# Altium schematic sheet DCSupplyHub.SchDoc
size A2; SheetNumber: 1; SheetTotal: 1
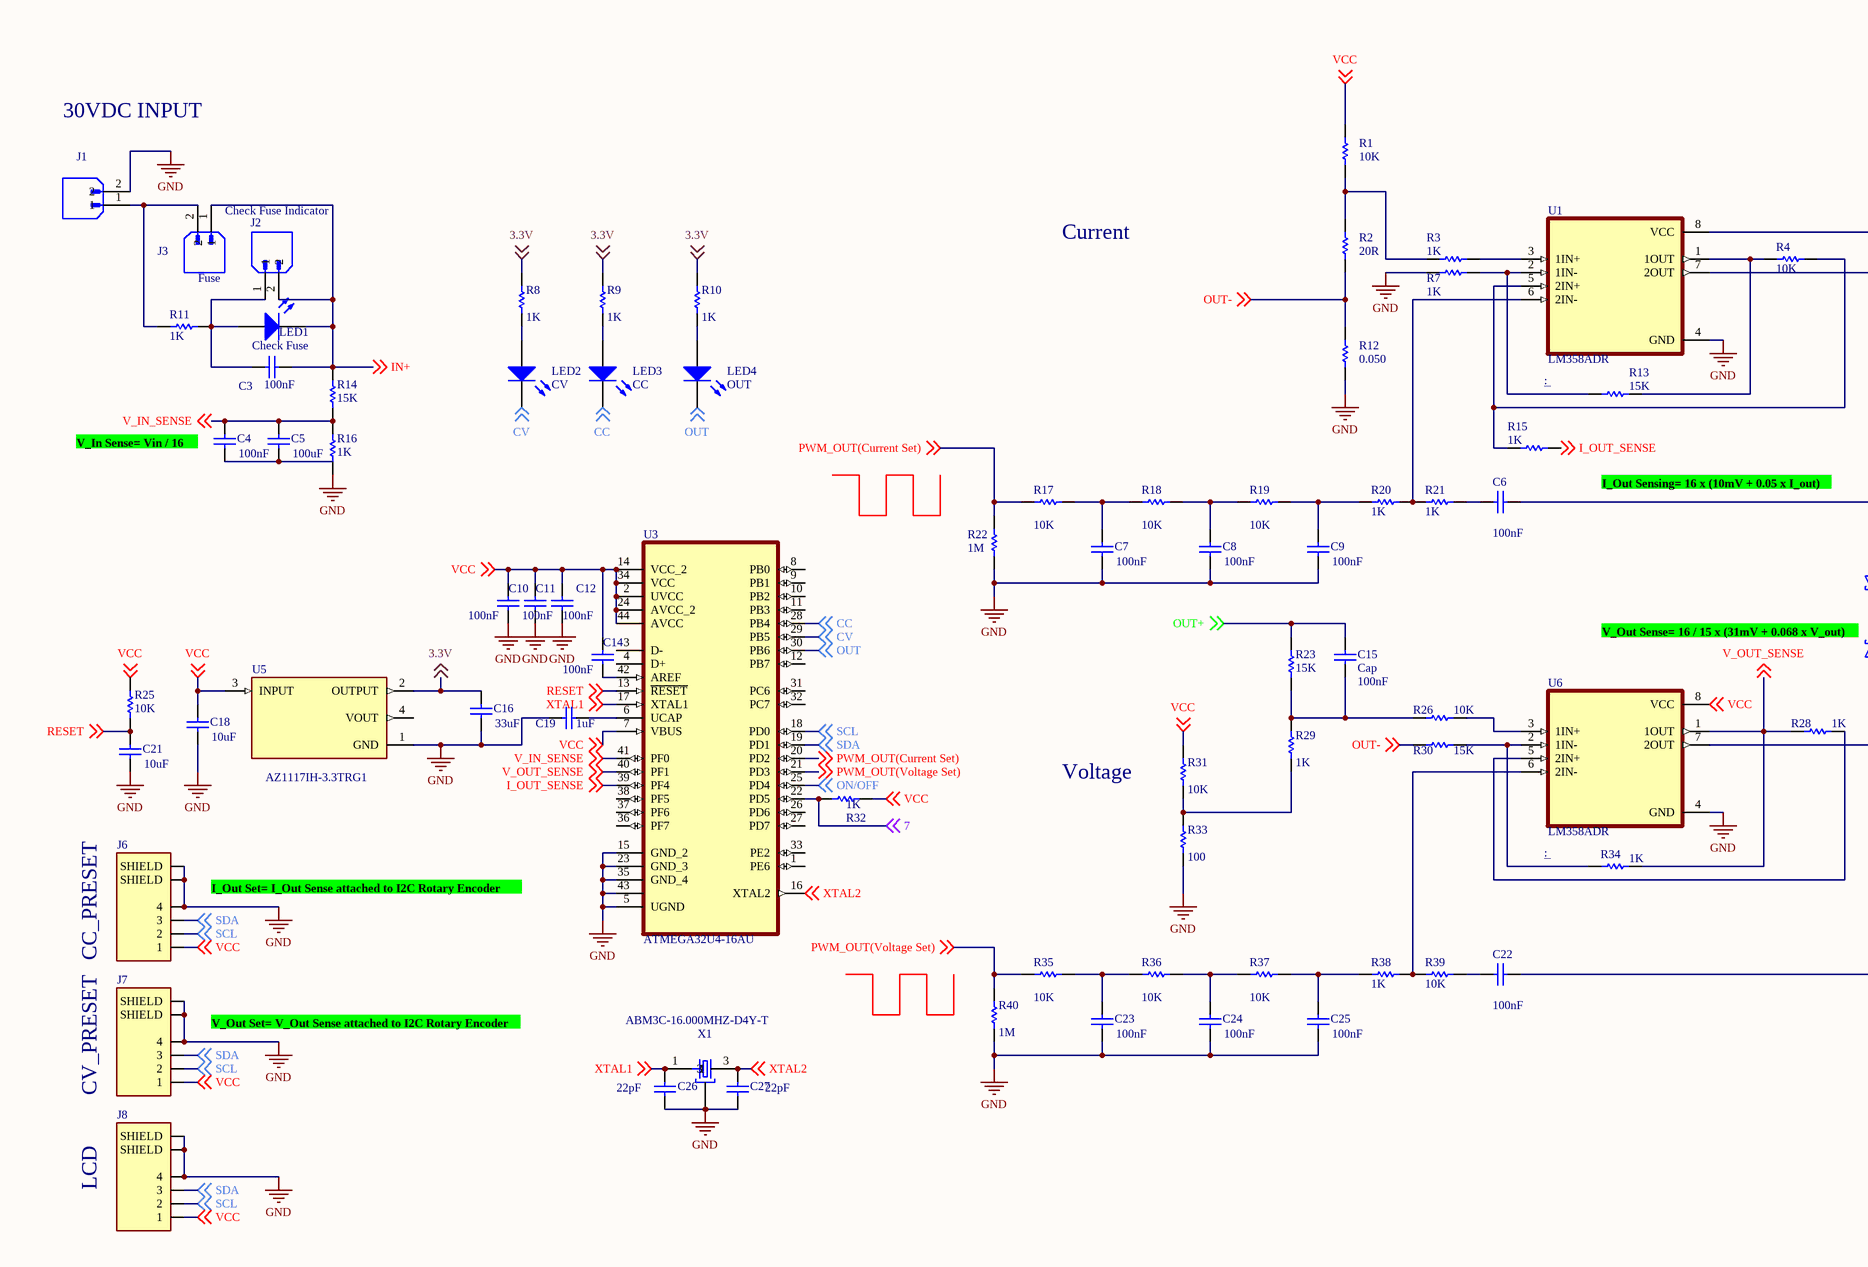
[diagram p0: DCSupplyHub.SchDoc, left]
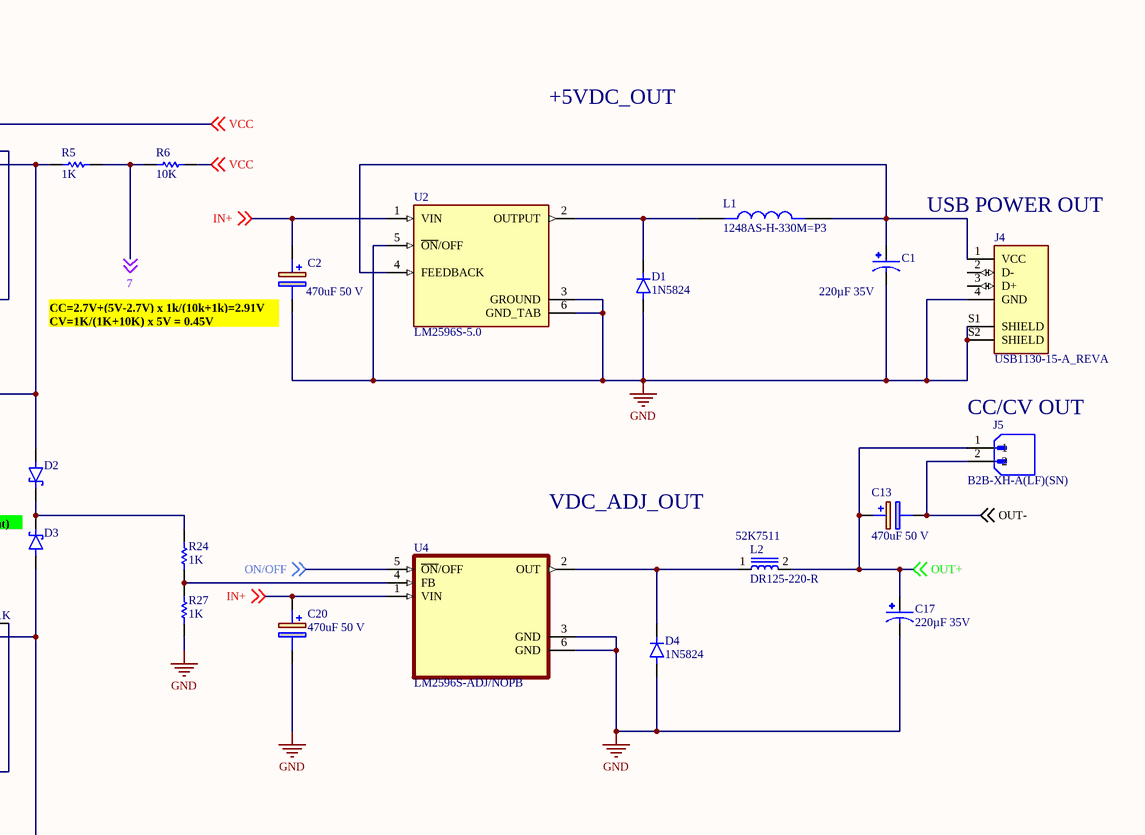
[diagram p1: DCSupplyHub.SchDoc, right]

## Parts
C1  Parameter 1: 220µF 35V  [CAP_EEEFP1V221AP]  (hidden comment: EEEFP1V221AP)
C2  value 470uF 50 V  [CAPAE1710X1700N]  (hidden comment: 865060663013)
C3  value 100nF  [CAPC3216X110N]  (hidden comment: Cap)
C4  value 100nF  [CAPC3216X110N]  (hidden comment: Cap)
C5  value 100uF  [CAPC3216X110N]  (hidden comment: Cap)
C6  value 100nF  [CAPC3216X110N]  (hidden comment: Cap)
C7  value 100nF  [CAPC3216X110N]  (hidden comment: Cap)
C8  value 100nF  [CAPC3216X110N]  (hidden comment: Cap)
C9  value 100nF  [CAPC3216X110N]  (hidden comment: Cap)
C10  value 100nF  [CAPC3216X110N]  (hidden comment: Cap)
C11  value 100nF  [CAPC3216X110N]  (hidden comment: Cap)
C12  value 100nF  [CAPC3216X110N]  (hidden comment: Cap)
C13  value 470uF 50 V  [CAPAE1710X1700N]  (hidden comment: 865060663013)
C14  value 100nF  [CAPC3216X110N]  (hidden comment: Cap)
C15  Cap  value 100nF  [CAPC3216X110N]
C16  value 33uF  [CAPC3216X110N]  (hidden comment: Cap)
C17  Parameter 1: 220µF 35V  [CAP_EEEFP1V221AP]  (hidden comment: EEEFP1V221AP)
C18  value 10uF  [CAPC3216X110N]  (hidden comment: Cap)
C19  value 1uF  [CAPC3216X110N]  (hidden comment: Cap)
C20  value 470uF 50 V  [CAPAE1710X1700N]  (hidden comment: 865060663013)
C21  value 10uF  [CAPC3216X110N]  (hidden comment: Cap)
C22  value 100nF  [CAPC3216X110N]  (hidden comment: Cap)
C23  value 100nF  [CAPC3216X110N]  (hidden comment: Cap)
C24  value 100nF  [CAPC3216X110N]  (hidden comment: Cap)
C25  value 100nF  [CAPC3216X110N]  (hidden comment: Cap)
C26  value 22pF  [CAPC3216X110N]  (hidden comment: Cap)
C27  value 22pF  [CAPC3216X110N]  (hidden comment: Cap)
D1  1N5824  [DIOAD1898W129L762D1143]
D2  SD1206S020S1R0  [DIOSC190X340X116-2N]  (value not drawn)
D3  SD1206S020S1R0  [DIOSC190X340X116-2N]  (value not drawn)
D4  1N5824  [DIOAD1898W129L762D1143]
J1  B2B-XH-A(LF)(SN)  [JST_B2B-XH-A(LF)(SN)]  (value not drawn)
J2  Check Fuse Indicator  [JST_B2B-XH-A(LF)(SN)]
J3  Fuse  [JST_B2B-XH-A(LF)(SN)]
J4  USB1130-15-A_REVA  [GCT_USB1130-15-A_REVA]
J5  B2B-XH-A(LF)(SN)  [JST_B2B-XH-A(LF)(SN)]
J6  CC_PRESET  [JST_SM04B-SRSS-TB(LF)(SN)]
J7  CV_PRESET  [JST_SM04B-SRSS-TB(LF)(SN)]
J8  LCD  [JST_SM04B-SRSS-TB(LF)(SN)]
L1  1248AS-H-330M=P3  [IND_1248AS-H-330M=P3]
L2  DR125-220-R  Supplier Part Number 1: 52K7511  [INDM1250X1250X600]
LED1  Check Fuse  [3.2X1.6X1.1]
LED2  CV  [3.2X1.6X1.1]
LED3  CC  [3.2X1.6X1.1]
LED4  OUT  [3.2X1.6X1.1]
R1  value 10K  [RESC3116X60N]  (hidden comment: Res1)
R2  value 20R  [RESC3116X60N]  (hidden comment: Res1)
R3  value 1K  [RESC3116X60N]  (hidden comment: Res1)
R4  value 10K  [RESC3116X60N]  (hidden comment: Res1)
R5  value 1K  [RESC3116X60N]  (hidden comment: Res1)
R6  value 10K  [RESC3116X60N]  (hidden comment: Res1)
R7  value 1K  [RESC3116X60N]  (hidden comment: Res1)
R8  value 1K  [RESC3116X60N]  (hidden comment: Res1)
R9  value 1K  [RESC3116X60N]  (hidden comment: Res1)
R10  value 1K  [RESC3116X60N]  (hidden comment: Res1)
R11  value 1K  [RESC3116X60N]  (hidden comment: Res1)
R12  value 0.050  [RESC3116X60N]  (hidden comment: Res1)
R13  value 15K  [RESC3116X60N]  (hidden comment: Res1)
R14  value 15K  [RESC3116X60N]  (hidden comment: Res1)
R15  value 1K  [RESC3116X60N]  (hidden comment: Res1)
R16  value 1K  [RESC3116X60N]  (hidden comment: Res1)
R17  value 10K  [RESC3116X60N]  (hidden comment: Res1)
R18  value 10K  [RESC3116X60N]  (hidden comment: Res1)
R19  value 10K  [RESC3116X60N]  (hidden comment: Res1)
R20  value 1K  [RESC3116X60N]  (hidden comment: Res1)
R21  value 1K  [RESC3116X60N]  (hidden comment: Res1)
R22  value 1M  [RESC3116X60N]  (hidden comment: Res1)
R23  value 15K  [RESC3116X60N]  (hidden comment: Res1)
R24  value 1K  [RESC3116X60N]  (hidden comment: Res1)
R25  value 10K  [RESC3116X60N]  (hidden comment: Res1)
R26  value 10K  [RESC3116X60N]  (hidden comment: Res1)
R27  value 1K  [RESC3116X60N]  (hidden comment: Res1)
R28  value 1K  [RESC3116X60N]  (hidden comment: Res1)
R29  value 1K  [RESC3116X60N]  (hidden comment: Res1)
R30  value 15K  [RESC3116X60N]  (hidden comment: Res1)
R31  value 10K  [RESC3116X60N]  (hidden comment: Res1)
R32  value 1K  [RESC3116X60N]  (hidden comment: Res1)
R33  value 100  [RESC3116X60N]  (hidden comment: Res1)
R34  value 1K  [RESC3116X60N]  (hidden comment: Res1)
R35  value 10K  [RESC3116X60N]  (hidden comment: Res1)
R36  value 10K  [RESC3116X60N]  (hidden comment: Res1)
R37  value 10K  [RESC3116X60N]  (hidden comment: Res1)
R38  value 1K  [RESC3116X60N]  (hidden comment: Res1)
R39  value 10K  [RESC3116X60N]  (hidden comment: Res1)
R40  value 1M  [RESC3116X60N]  (hidden comment: Res1)
U1  LM358ADR  [SOIC127P599X175-8N]
U2  LM2596S-5.0  [TO170P1524X483-6N]
U3  ATMEGA32U4-16AU  [QFP80P1200X1200X120-44N]
U4  LM2596S-ADJ/NOPB  [VREG_LM2596S-ADJ/NOPB]
U5  AZ1117IH-3.3TRG1  [SOT230P700X185-4N]
U6  LM358ADR  [SOIC127P599X175-8N]
X1  ABM3C-16.000MHZ-D4Y-T  [OSCCC500X320X110-4N]

## Nets
GND: C1.2 C2.2(-) C7.1 C8.1 C9.1 C10.1 C11.1 C12.1 C16.1 C17.2 C18.1 C19.2 C20.2(-) C21.1 C23.1 C24.1 C25.1 C26.1 C27.1 D1.A D4.A J1.2 J4.4(GND) J4.S1(SHIELD) J4.S2(SHIELD) J6.4 J6.S1(SHIELD) J6.S2(SHIELD) J7.4 J7.S1(SHIELD) J7.S2(SHIELD) J8.4 J8.S1(SHIELD) J8.S2(SHIELD) R7.1 R12.1 R16.2 R22.1 R27.2 R33.1 R40.1 U1.4(GND) U2.3(GROUND) U2.5(~{ON}/OFF) U2.6(GND_TAB) U3.5(UGND) U3.15(GND_2) U3.23(GND_3) U3.35(GND_4) U3.43(GND) U4.3(GND) U4.6(GND) U5.1(GND) U6.4(GND) X1.2(GND) X1.4(GND)
3.3V: C16.2 R8.1 R9.1 R10.1 U5.2(OUTPUT) ; off-sheet 3.3V
7: R5.2 R6.1 R32.2 U3.22(PD5) ; off-sheet 7
CC: LED3.2(K) U3.28(PB4) ; off-sheet CC
CV: LED2.2(K) U3.29(PB5) ; off-sheet CV
I_OUT_SENSE: R15.1 U3.39(PF4) ; off-sheet I_OUT_SENSE
IN+: C2.1(+) C3.1 C20.1(+) J2.2 J3.1 LED1.2(K) R14.1 U2.1(VIN) U4.1(VIN) ; off-sheet IN+
ON/OFF: U3.25(PD4) U4.5(~{ON}/OFF) ; off-sheet ON/OFF
OUT: LED4.2(K) U3.30(PB6) ; off-sheet OUT
OUT+: C13.1(+) C15.1 C17.1 J5.1 L2.2 R23.2 ; off-sheet OUT+
OUT-: C13.2(-) J5.2 R2.2 R12.2 R30.1 ; off-sheet OUT-
PWM_OUT(Current Set): R17.2 R22.2 U3.20(PD2) ; off-sheet PWM_OUT(Current Set)
PWM_OUT(Voltage Set): R35.2 R40.2 U3.21(PD3) ; off-sheet PWM_OUT(Voltage Set)
RESET: C21.2 R25.2 U3.13(~{RESET}) ; off-sheet RESET
SCL: J6.2 J7.2 J8.2 U3.18(PD0) ; off-sheet SCL
SDA: J6.3 J7.3 J8.3 U3.19(PD1) ; off-sheet SDA
V_IN_SENSE: C4.2 C5.2 R14.2 R16.1 U3.41(PF0) ; off-sheet V_IN_SENSE
V_OUT_SENSE: R28.1 R34.2 U3.40(PF1) U6.1(1OUT) ; off-sheet V_OUT_SENSE
VCC: C10.2 C11.2 C12.2 C14.2 C18.2 J6.1 J7.1 J8.1 R1.2 R6.2 R25.1 R31.1 R32.1 U1.8(VCC) U3.2(UVCC) U3.7(VBUS) U3.14(VCC_2) U3.24(AVCC_2) U3.34(VCC) U3.44(AVCC) U5.3(INPUT) U6.8(VCC) ; off-sheet VCC
XTAL1: C26.2 U3.17(XTAL1) X1.1 ; off-sheet XTAL1
XTAL2: C27.2 U3.16(XTAL2) X1.3 ; off-sheet XTAL2
NetC1_1: C1.1 J4.1(VCC) L1.2 U2.4(FEEDBACK)
NetC3_2: C3.2 J2.1 LED1.1(A) R11.2
NetC4_1: C4.1 C5.1
NetC6_1: C6.1 R21.2
NetC6_2: C6.2 D2.A R5.1 U1.7(2OUT)
NetC7_2: C7.2 R17.1 R18.2
NetC8_2: C8.2 R18.1 R19.2
NetC9_2: C9.2 R19.1 R20.1
NetC14_1: C14.1 U3.42(AREF)
NetC15_2: C15.2 R23.1 R26.1 R29.1
NetC19_1: C19.1 U3.6(UCAP)
NetC22_1: C22.1 R39.2
NetC22_2: C22.2 D3.A U6.7(2OUT)
NetC23_2: C23.2 R35.1 R36.2
NetC24_2: C24.2 R36.1 R37.2
NetC25_2: C25.2 R37.1 R38.1
NetD1_C: D1.C(K) L1.1 U2.2(OUTPUT)
NetD2_C: D2.C(K) D3.C(K) R24.1
NetD4_C: D4.C(K) L2.1 U4.2(OUT)
NetJ1_1: J1.1 J3.2 R11.1
NetLED2_1: LED2.1(A) R8.2
NetLED3_1: LED3.1(A) R9.2
NetLED4_1: LED4.1(A) R10.2
NetR1_1: R1.1 R2.1 R3.1
NetR3_2: R3.2 U1.3(1IN+)
NetR4_1: R4.1 R13.2 U1.1(1OUT)
NetR4_2: R4.2 R15.2 U1.5(2IN+)
NetR7_2: R7.2 R13.1 U1.2(1IN-)
NetR20_2: R20.2 R21.1 U1.6(2IN-)
NetR24_2: R24.2 R27.1 U4.4(FB)
NetR26_2: R26.2 U6.3(1IN+)
NetR28_2: R28.2 U6.5(2IN+)
NetR29_2: R29.2 R31.2 R33.2
NetR30_2: R30.2 R34.1 U6.2(1IN-)
NetR38_2: R38.2 R39.1 U6.6(2IN-)

Not connected (* = marked no-connect by the designer): J4 2(D-) 3(D+); U3 1(PE6) 3(D-) 4(D+) 8(PB0) 9(PB1) 10(PB2) 11(PB3) 12(PB7) 26(PD6) 27(PD7) 31(PC6) 32(PC7) 33(PE2) 36(PF7) 37(PF6) 38(PF5); U5 4(VOUT)

## Notes on the sheet
- 30VDC INPUT
- Current
- +5VDC_OUT
- USB POWER OUT
- (near C4) V_In Sense= Vin / 16
- (near C2) CC=2.7V+(5V-2.7V) x 1k/(10k+1k)=2.91V
- (near C2) CV=1K/(1K+10K) x 5V = 0.45V
- I_Out Sensing= 16 x (10mV + 0.05 x I_out)
- (near J5) CC/CV OUT
- (near D3) V_Out Sense= 16 / 15 x (31mV + 0.068 x V_out)
- VDC_ADJ_OUT
- Voltage
- (near J6) I_Out Set= I_Out Sense attached to I2C Rotary Encoder
- (near J7) V_Out Set= V_Out Sense attached to I2C Rotary Encoder

## Library data of the parts
C1 C17 = EEEFP1V221AP: 220ÂµF 35V Aluminum Electrolytic Capacitors Radial, Can - SMD 80mOhm @ 100kHz 2000 Hrs @ 105Â°C; MP: EEE-FP1V221AP; MF: Panasonic Electronic; Availability: In Stock; SnapEDA_Link: https://www.snapeda.com/parts/EEE-FP1V221AP/Panasonic%20Electronic%20Components/view-part/2297683/?ref=snap; Value: *; Price: None; Package: RADIAL-2 Panasonic; Check_prices: https://www.snapeda.com/parts/EEE-FP1V221AP/Panasonic%20Electronic%20Components/view-part/2297683/?ref=eda; Purchase-URL: https://pricing.snapeda.com/search/part/EEE-FP1V221AP/?ref=eda
C2 C13 C20 = 865060663013: Wurth Elektronik 470uF 50 V dc Aluminium Electrolytic Capacitor, WCAP-ASLL Series 5000h 17 (Dia.) x 15.85mm; Geometry.Height: 17mm; Manufacturer_Name: Wurth Elektronik; Manufacturer_Part_Number: 865060663013; Mouser Part Number: 710-865060663013; Mouser Price/Stock: https://www.mouser.co.uk/ProductDetail/Wurth-Elektronik/865060663013?qs=0KOYDY2FL2%2FaLIoB1obSkw%3D%3D; Arrow Part Number: *; Arrow Price/Stock: *; Datasheet Link: https://componentsearchengine.com/Datasheets/2/865060663013.pdf
  C20: Parameter 2: *; Parameter 3: *
C3-C12 C14-C16 C18 C19 C21-C27 = Cap: Capacitor; Published: 8-Jun-2000; LatestRevisionDate: 17-Jul-2002; LatestRevisionNote: Re-released for DXP Platform.; PackageReference: RAD-0.3; Publisher: Altium Limited; PackageDescription: Radial Cap, Thru-Hole; 2 Leads; 0.3 in Pin Spacing
D1 D4 = 1N5824: Diode Schottky 30V 5A Through Hole Axial; MF: Microsemi Corporation; Value: *; SnapEDA_Link: https://www.snapeda.com/parts/1N5824/Microsemi%20Corporation/view-part/49055/?ref=snap; MP: 1N5824; Availability: Unavailable; Price: None; Package: Axial Microsemi
D2 D3 = SD1206S020S1R0: Diode Schottky 20 V 1A (DC) Surface Mount 1206 (3216 Metric); MF: AVX; MP: SD1206S020S1R0; Price: None; Purchase-URL: https://pricing.snapeda.com/search/part/SD1206S020S1R0/?ref=eda; Package: None; Check_prices: https://www.snapeda.com/parts/SD1206S020S1R0/AVX/view-part/?ref=eda; Value: *; Availability: In Stock; SnapEDA_Link: https://www.snapeda.com/parts/SD1206S020S1R0/AVX/view-part/?ref=snap
J1-J3 J5 = B2B-XH-A(LF)(SN): Connector Header Through Hole 2 position 0.098 (2.50mm); MF: JST Sales; SnapEDA_Link: https://www.snapeda.com/parts/B2B-XH-A(LF)(SN)/JST+Sales+America+Inc./view-part/?ref=snap; Package: None; Value: *; MP: B2B-XH-A(LF)(SN); Check_prices: https://www.snapeda.com/parts/B2B-XH-A(LF)(SN)/JST+Sales+America+Inc./view-part/?ref=eda
J4 = USB1130-15-A_REVA: USB 2.0 Connector Full size Horizontal Plug, type A, 4 Pins, Through hole, Top mount, 6.99mm profile, High mating cycle, charging receptacle; MF: Global Connector Technology; Price: None; Availability: In Stock; Package: None; MP: USB1130-15-A; Value: *; SnapEDA_Link: https://www.snapeda.com/parts/USB1130-15-A/Global+Connector+Technology/view-part/?ref=snap; Purchase-URL: https://pricing.snapeda.com/search/part/USB1130-15-A/?ref=eda; Check_prices: https://www.snapeda.com/parts/USB1130-15-A/Global+Connector+Technology/view-part/?ref=eda
J6-J8 = SM04B-SRSS-TB(LF)(SN): SH Series 1.0 mm Pitch 2 Position Single Row Side Entry Shrouded Header; Price: None; Value: *; MP: SM04B-SRSS-TB(LF)(SN); Package: None; Availability: Unavailable
L1 = 1248AS-H-330M=P3: Inductor with Inductance: 33uH Tol. +/-20%, Package: 3131 _8080_; MF: Murata; Digi-Key_Purchase_URL: https://www.digikey.com/product-detail/en/murata-electronics/1248AS-H-330M=P3/490-10797-1-ND/5271539?utm_source=snapeda&utm_medium=aggregator&utm_campaign=symbol; Digi-Key_Part_Number: 490-10797-1-ND; MP: 1248AS-H-330M=P3; Value: *; SnapEDA_Link: https://www.snapeda.com/parts/1248AS-H-330M%3DP3/Murata/view-part/4548511/?ref=snap; Package: - Murata
L2 = DR125-220-R: Inductor Power Shielded Drum Core 3.084u(OCL)H/3.3uH 20% 100KHz Ferrite 9.26A 6.3mOhm DCR T/R; Package: None; Price: None; Value: *; MP: DR125-220-R; Availability: Unavailable; Supplier 1: Avnet
LED1-LED4 = LED2: Typical RED, GREEN, YELLOW, AMBER GaAs LED; Published: 8-Jun-2000; LatestRevisionDate: 17-Jul-2002; LatestRevisionNote: Re-released for DXP Platform.; PackageVersion: Feb-2002; PackageReference: 3.2X1.6X1.1; Publisher: Altium Limited; PackageDescription: SM LED; 2 Flat Leads
R1-R40 = Res1: Resistor; Published: 8-Jun-2000; LatestRevisionDate: 17-Jul-2002; LatestRevisionNote: Re-released for DXP Platform.; PackageReference: AXIAL-0.3; Publisher: Altium Limited; PackageDescription: Axial Device, Thru-Hole; 2 Leads; 0.3 in Pin Spacing
U1 U6 = LM358ADR: Dual improved offset, standard operational amplifier<br /> &nbsp; 8-SOIC 0 to 70; MF: Texas Instruments; DigiKey-Purchase-URL: https://snapeda.com/shop?store=DigiKey&id=348453; Mouser-Purchase-URL: https://snapeda.com/shop?store=Mouser&id=348453; SnapEDA_Link: https://www.snapeda.com/parts/LM358ADR/Texas%20Instruments/view-part/348453/?ref=snap; Price: None; MP: LM358ADR; Value: *; Availability: Good; Texas_Instruments-Purchase-URL: https://snapeda.com/shop?store=Texas+Instruments&id=348453; Package: SOIC-8 Texas Instruments
U2 = LM2596S-5.0: SIMPLE SWITCHER&reg; 4.5V to 40V, 3A Low Component Count Step-Down Regulator; MP: LM2596S-5.0/NOPB; MF: Texas Instruments; Price: None; Availability: In Stock; Package: TO-263-5 Texas Instruments; SnapEDA_Link: https://www.snapeda.com/parts/LM2596S-5.0/NOPB/Texas+Instruments/view-part/?ref=snap; Check_prices: https://www.snapeda.com/parts/LM2596S-5.0/NOPB/Texas+Instruments/view-part/?ref=eda; Value: *; Purchase-URL: https://pricing.snapeda.com/search/part/LM2596S-5.0/NOPB/?ref=eda
U3 = ATMEGA32U4-16AU: Microcontroladores de 8 bits - MCU 32K Flash; MF: Microchip Technology / Atmel; Availability: Unavailable; Price: None; SnapEDA_Link: https://www.snapeda.com/parts/ATMEGA32U4-16AU/Atmel/view-part/4705464/?ref=snap; Package: None; Value: *; MP: ATMEGA32U4-16AU; Parameter 1: *
U4 = LM2596S-ADJ/NOPB: SIMPLE SWITCHER&reg; 4.5V to 40V, 3A Low Component Count Step-Down Regulator; MF: Texas Instruments; Price: None; Package: TO-263-5 Texas Instruments; Purchase-URL: https://pricing.snapeda.com/search/part/LM2596S-ADJ/NOPB/?ref=eda; Availability: In Stock; SnapEDA_Link: https://www.snapeda.com/parts/LM2596S-ADJ/NOPB/Texas+Instruments/view-part/?ref=snap; Value: *; MP: LM2596S-ADJ/NOPB; Check_prices: https://www.snapeda.com/parts/LM2596S-ADJ/NOPB/Texas+Instruments/view-part/?ref=eda
U5 = AZ1117IH-3.3TRG1: Linear Voltage Regulator IC Positive Fixed 1 Output 1A SOT-223-3; MF: Diodes Inc.; Check_prices: https://www.snapeda.com/parts/AZ1117IH-3.3TRG1/Diodes+Inc./view-part/?ref=eda; Value: *; Availability: In Stock; MP: AZ1117IH-3.3TRG1; Price: None; Package: SOT-223 Diodes Inc.; SnapEDA_Link: https://www.snapeda.com/parts/AZ1117IH-3.3TRG1/Diodes+Inc./view-part/?ref=snap; Purchase-URL: https://pricing.snapeda.com/search/part/AZ1117IH-3.3TRG1/?ref=eda
X1 = ABM3C-16.000MHZ-D4Y-T: 16MHz Â±30ppm Crystal 18pF 50 Ohms 4-SMD, No Lead; MF: Abracon; Price: None; Value: *; Package: SMD-4 Abracon; Availability: Unavailable; SnapEDA_Link: https://www.snapeda.com/parts/ABM3C-16.000MHZ-D4Y-T/Abracon%20LLC/view-part/463692/?ref=snap; MP: ABM3C-16.000MHZ-D4Y-T